# EAGLE design bouton (EAGLE 7.6.0)
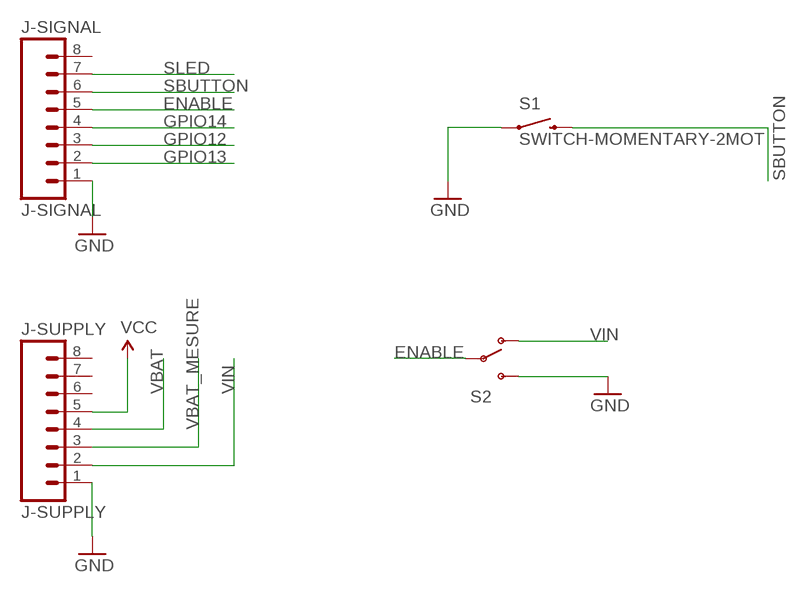
[diagram p0: schematic, sheet 1]

## Parts
J-SIGNAL  J-SIGNAL  M08  [1X08_ROUND]
J-SUPPLY  J-SUPPLY  M08  [1X08_ROUND]
S1  SWITCH-MOMENTARY-2MOT  [TACTILE-PTH]
S2  SWITCH-SPDTSMD2  [SWITCH-SPDT-SMD]

## Nets
ENABLE: J-SIGNAL.5 S2.2(P)
GND: J-SIGNAL.1 J-SUPPLY.1 S1.1 S2.3(S)
GPIO12: J-SIGNAL.3
GPIO13: J-SIGNAL.2
GPIO14: J-SIGNAL.4
SBUTTON: J-SIGNAL.6 S1.4
SLED: J-SIGNAL.7
VBAT [SUPPLY]: J-SUPPLY.4
VBAT_MESURE [SUPPLY]: J-SUPPLY.3
VCC [SUPPLY]: J-SUPPLY.5
VIN [SUPPLY]: J-SUPPLY.2 S2.1(O)
Unconnected: J-SIGNAL.8 J-SUPPLY.6 J-SUPPLY.7 J-SUPPLY.8

## Library data of the parts
J-SIGNAL J-SUPPLY = SparkFun-Connectors:M08: Header 8 Standard 8-pin 0.1" header. Use with straight break away headers (SKU : PRT-00116), right angle break away headers (PRT-00553), swiss pins (PRT-00743), machine pins (PRT-00117), and female headers (PRT-00115).; PROD_ID: CONN-08437
S1 = SparkFun-Electromechanical:SWITCH-MOMENTARY-2: Various NO switches- pushbuttons, reed, etc
S2 = SparkFun-Electromechanical:SWITCH-SPDT: SPDT Switch Simple slide switch, Spark Fun Electronics SKU : COM-00102 DPDT SMT slide switch, AYZ0202, SWCH-08179

## Net classes
0 default: width 0.3 mm
1 GND: width 0.5 mm, clearance 0.5 mm
2 SUPPLY: width 0.5 mm, clearance 0.003 mm

## Board
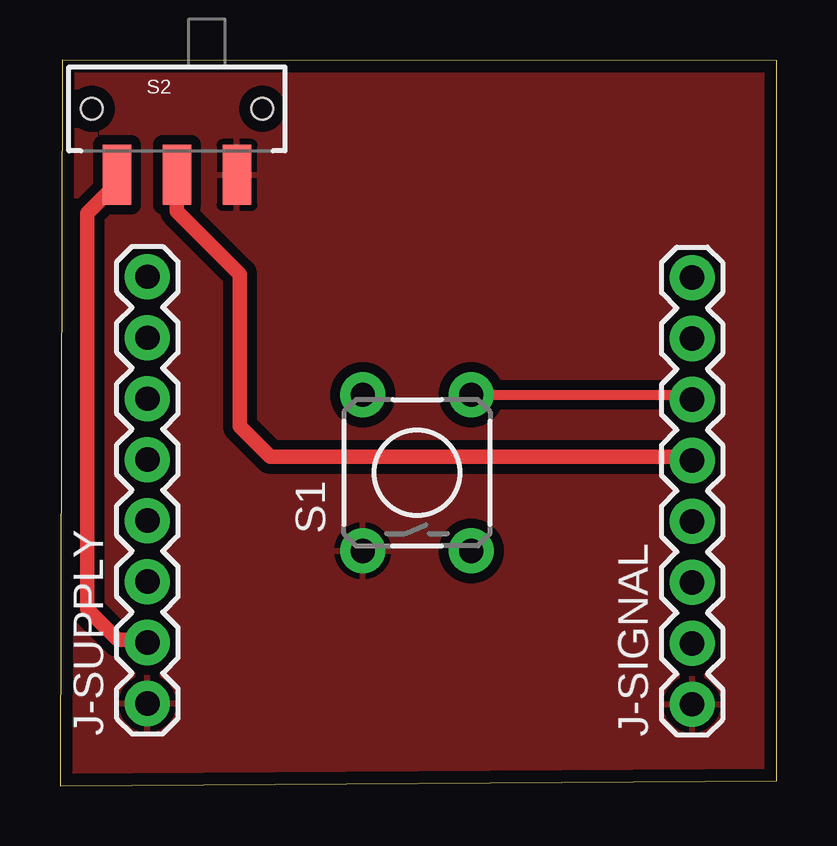
[diagram p1: board, top side]

Size 29.87 x 30.24 mm. Coordinates in mm from the lower left corner, seen from the top.
Outline: 0,0 29.87,0.2 29.87,30.2 0.09,30.24 0,0
Copper layers (1*16): Top 0.035mm / dielectric 1.5mm / Bottom 0.035mm
Design rules "DRC": minimum track width 10mil, minimum drill 20mil, track to track 4mil, track to pad 4mil, pad to pad 2mil, via to via 2mil, smd to smd 2mil, copper to edge 20mil, drill to drill 8mil, minimum pad ring 10mil, minimum via ring 8mil, stop-mask expansion 4mil, vias tented up to drill 0mil, thermal gap 10mil

### Footprints (pad centres in the part's own frame; a part is rotated, then mirrored left to right if it is on the bottom)
1X08_ROUND = drill 1.016 pad 1.88: 1 0,0; 2 2.54,0; 3 5.08,0; 4 7.62,0; 5 10.16,0; 6 12.7,0; 7 15.24,0; 8 17.78,0
TACTILE-PTH = drill 1.016 pad 1.88: 1 -3.251,2.261; 2 3.251,2.261; 3 -3.251,-2.261; 4 3.251,-2.261
SWITCH-SPDT-SMD = smd 1.2 x 2.5: 1 -2.5,-2.75; 2 0,-2.75; 3 2.5,-2.75 | hole 0.9: -3.55,0; 3.55,0

### Placement (x,y rotation side)
J-SIGNAL  26.34,3.4 90 top
J-SUPPLY  3.64,3.43 90 top
S1  14.87,13.04 90 top
S2  4.87,28.2 0 top

### Tracks (layer width: path | path; a pad name or v marks a point on that pad's centre or on a via)
ENABLE
  Top 0.61: S2.2 4.87,23.94 7.49,21.32 7.49,14.97 8.76,13.7 26.19,13.7 J-SIGNAL.5
GND
  pour Top (isolate 0.406): 0.08,30.1 29.87,30.2 30.05,0.2 0.09,-0.04
SBUTTON
  Top 0.406: S1.4 26.34,16.3 J-SIGNAL.6
VIN
  Top 0.61: S2.1 2.37,25.09 1.14,23.86 1.14,7.35 2.41,6.08 3.53,6.08 J-SUPPLY.2